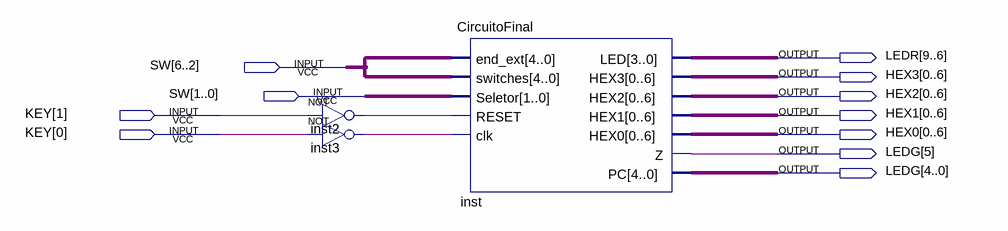
[diagram p0: schematic sheet]
// Quartus schematic CircuitoPlaca.bdf as structural Verilog: 3 symbols, 11 pins
module CircuitoPlaca (
  input  [6:0] SW,
  input  [1:0] KEY,
  output [9:6] LEDR,
  output [0:6] HEX3,
  output [0:6] HEX2,
  output [0:6] HEX1,
  output [0:6] HEX0,
  output [5:0] LEDG
);

  wire inst2_out, inst3_out;

  not inst2 (inst2_out, KEY[1]);
  not inst3 (inst3_out, KEY[0]);
  CircuitoFinal inst (
    .end_ext(SW[6:2]), .switches(SW[6:2]), .Seletor(SW[1:0]), .RESET(inst2_out), .clk(inst3_out), .LED(LEDR),
    .HEX3(HEX3), .HEX2(HEX2), .HEX1(HEX1), .HEX0(HEX0), .Z(LEDG[5]), .PC(LEDG[4:0]));
endmodule
